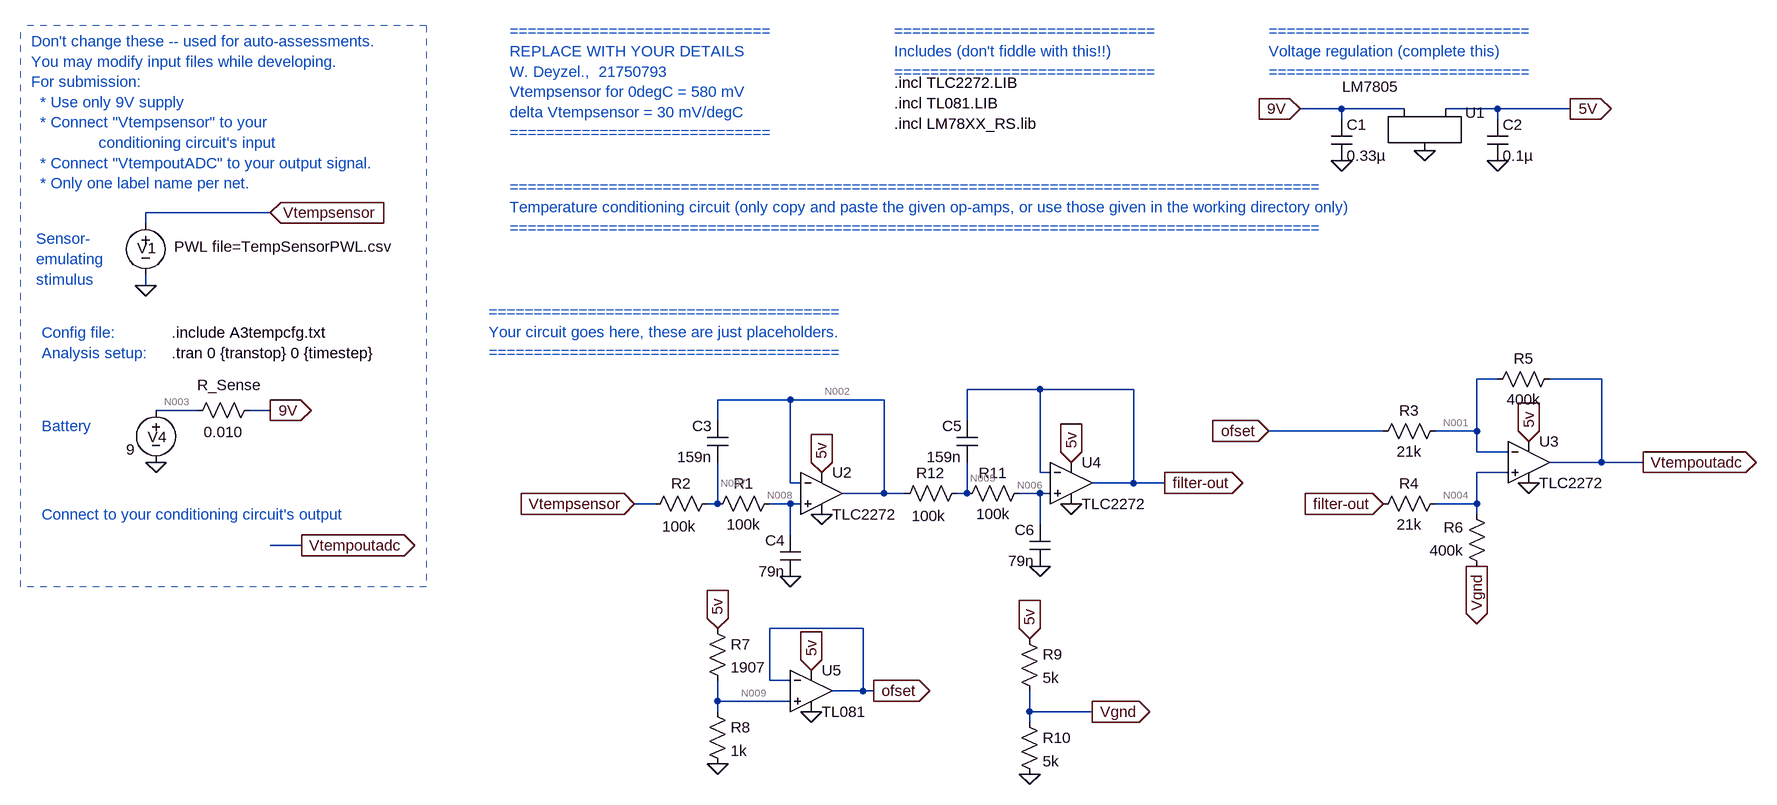
[diagram p0: schematic E344_A3_temp.asc]
E344_A3_temp.asc, the LTspice schematic file:
Version 4
SHEET 1 1824 680
WIRE -272 -1280 -336 -1280
WIRE -176 -1280 -272 -1280
WIRE -32 -1280 -112 -1280
WIRE 80 -1280 -32 -1280
WIRE -272 -1264 -272 -1280
WIRE -32 -1264 -32 -1280
WIRE -1920 -1120 -2112 -1120
WIRE -2112 -1104 -2112 -1120
WIRE -2112 -1008 -2112 -1024
WIRE -32 -864 -64 -864
WIRE 128 -864 48 -864
WIRE -736 -848 -848 -848
WIRE -592 -848 -736 -848
WIRE -1120 -832 -1232 -832
WIRE -976 -832 -1120 -832
WIRE -2032 -816 -2096 -816
WIRE -1920 -816 -1952 -816
WIRE -1232 -800 -1232 -832
WIRE -848 -800 -848 -848
WIRE -208 -784 -384 -784
WIRE -64 -784 -64 -864
WIRE -64 -784 -128 -784
WIRE -64 -752 -64 -784
WIRE -16 -752 -64 -752
WIRE 128 -736 128 -864
WIRE 128 -736 48 -736
WIRE 192 -736 128 -736
WIRE -736 -720 -736 -848
WIRE -720 -720 -736 -720
WIRE -16 -720 -64 -720
WIRE -1120 -704 -1120 -832
WIRE -1104 -704 -1120 -704
WIRE -592 -704 -592 -848
WIRE -592 -704 -656 -704
WIRE -544 -704 -592 -704
WIRE -976 -688 -976 -832
WIRE -976 -688 -1040 -688
WIRE -944 -688 -976 -688
WIRE -848 -688 -848 -736
WIRE -848 -688 -864 -688
WIRE -736 -688 -768 -688
WIRE -720 -688 -736 -688
WIRE -1328 -672 -1360 -672
WIRE -1232 -672 -1232 -736
WIRE -1232 -672 -1248 -672
WIRE -1120 -672 -1152 -672
WIRE -1104 -672 -1120 -672
WIRE -64 -672 -64 -720
WIRE -64 -672 -128 -672
WIRE -64 -656 -64 -672
WIRE -736 -640 -736 -688
WIRE -1120 -624 -1120 -672
WIRE -1872 -608 -1920 -608
WIRE -1008 -480 -1152 -480
WIRE -1152 -400 -1152 -480
WIRE -1120 -400 -1152 -400
WIRE -1008 -384 -1008 -480
WIRE -1008 -384 -1056 -384
WIRE -992 -384 -1008 -384
WIRE -1232 -368 -1232 -400
WIRE -1120 -368 -1232 -368
WIRE -1232 -352 -1232 -368
WIRE -752 -352 -752 -384
WIRE -656 -352 -752 -352
WIRE -752 -336 -752 -352
FLAG -2112 -1008 0
FLAG -1920 -1120 Vtempsensor
IOPIN -1920 -1120 In
FLAG -1920 -816 9V
IOPIN -1920 -816 Out
FLAG -2096 -736 0
FLAG -336 -1280 9V
IOPIN -336 -1280 In
FLAG -1360 -672 Vtempsensor
IOPIN -1360 -672 In
FLAG -144 -1216 0
FLAG 80 -1280 5V
IOPIN 80 -1280 Out
FLAG 192 -736 Vtempoutadc
IOPIN 192 -736 Out
FLAG -1872 -608 Vtempoutadc
IOPIN -1872 -608 Out
FLAG -272 -1200 0
FLAG -32 -1200 0
FLAG -1072 -656 0
FLAG -1072 -720 5v
IOPIN -1072 -720 In
FLAG -544 -704 filter-out
IOPIN -544 -704 Out
FLAG -1120 -560 0
FLAG -1232 -480 5v
IOPIN -1232 -480 In
FLAG -1232 -272 0
FLAG -992 -384 ofset
IOPIN -992 -384 Out
FLAG -208 -672 filter-out
IOPIN -208 -672 In
FLAG 16 -704 0
FLAG 16 -768 5v
IOPIN 16 -768 In
FLAG -752 -464 5v
IOPIN -752 -464 In
FLAG -752 -256 0
FLAG -656 -352 Vgnd
IOPIN -656 -352 Out
FLAG -64 -576 Vgnd
IOPIN -64 -576 Out
FLAG -688 -672 0
FLAG -688 -736 5v
IOPIN -688 -736 In
FLAG -736 -576 0
FLAG -384 -784 ofset
IOPIN -384 -784 In
FLAG -1088 -352 0
FLAG -1088 -416 5v
IOPIN -1088 -416 In
SYMBOL voltage -2112 -1120 R0
WINDOW 123 0 0 Left 0
WINDOW 39 0 0 Left 0
WINDOW 3 44 52 Left 2
WINDOW 0 -13 54 Left 2
SYMATTR Value PWL file=TempSensorPWL.csv
SYMATTR InstName V1
SYMBOL voltage -2096 -832 R0
WINDOW 123 24 44 Left 2
WINDOW 39 0 0 Left 0
WINDOW 3 -46 76 Left 2
WINDOW 0 -13 57 Left 2
SYMATTR Value 9
SYMATTR InstName V4
SYMBOL res -1936 -832 R90
WINDOW 0 -7 47 VBottom 2
WINDOW 3 34 56 VTop 2
SYMATTR InstName R_Sense
SYMATTR Value 0.010
SYMBOL LM7805 -144 -1264 R0
WINDOW 3 -83 -66 Top 2
SYMATTR InstName U1
SYMBOL cap -288 -1264 R0
SYMATTR InstName C1
SYMATTR Value 0.33µ
SYMBOL cap -48 -1264 R0
SYMATTR InstName C2
SYMATTR Value 0.1µ
SYMBOL res -1136 -688 R90
WINDOW 0 0 56 VBottom 2
WINDOW 3 32 56 VTop 2
SYMATTR InstName R1
SYMATTR Value 100k
SYMBOL res -1232 -688 R90
WINDOW 0 0 56 VBottom 2
WINDOW 3 35 59 VTop 2
SYMATTR InstName R2
SYMATTR Value 100k
SYMBOL cap -1216 -736 R180
WINDOW 0 24 56 Left 2
WINDOW 3 24 8 Left 2
SYMATTR InstName C3
SYMATTR Value 159n
SYMBOL cap -1104 -560 R180
WINDOW 0 24 56 Left 2
WINDOW 3 24 8 Left 2
SYMATTR InstName C4
SYMATTR Value 79n
SYMBOL Opamps\\opamp2 -1072 -752 R0
SYMATTR InstName U2
SYMATTR Value TLC2272
SYMBOL res -112 -800 R90
WINDOW 0 0 56 VBottom 2
WINDOW 3 32 56 VTop 2
SYMATTR InstName R3
SYMATTR Value 21k
SYMBOL res -112 -688 R90
WINDOW 0 0 56 VBottom 2
WINDOW 3 32 56 VTop 2
SYMATTR InstName R4
SYMATTR Value 21k
SYMBOL res 64 -880 R90
WINDOW 0 0 56 VBottom 2
WINDOW 3 32 56 VTop 2
SYMATTR InstName R5
SYMATTR Value 400k
SYMBOL res -48 -560 R180
WINDOW 0 36 76 Left 2
WINDOW 3 36 40 Left 2
SYMATTR InstName R6
SYMATTR Value 400k
SYMBOL res -1248 -496 R0
SYMATTR InstName R7
SYMATTR Value 1907
SYMBOL res -1248 -368 R0
SYMATTR InstName R8
SYMATTR Value 1k
SYMBOL Opamps\\opamp2 16 -800 R0
SYMATTR InstName U3
SYMATTR Value TLC2272
SYMBOL res -768 -480 R0
SYMATTR InstName R9
SYMATTR Value 5k
SYMBOL res -768 -352 R0
SYMATTR InstName R10
SYMATTR Value 5k
SYMBOL res -752 -704 R90
WINDOW 0 0 56 VBottom 2
WINDOW 3 32 56 VTop 2
SYMATTR InstName R11
SYMATTR Value 100k
SYMBOL res -848 -704 R90
WINDOW 0 0 56 VBottom 2
WINDOW 3 35 59 VTop 2
SYMATTR InstName R12
SYMATTR Value 100k
SYMBOL cap -832 -736 R180
WINDOW 0 24 56 Left 2
WINDOW 3 24 8 Left 2
SYMATTR InstName C5
SYMATTR Value 159n
SYMBOL cap -720 -576 R180
WINDOW 0 24 56 Left 2
WINDOW 3 24 8 Left 2
SYMATTR InstName C6
SYMATTR Value 79n
SYMBOL Opamps\\opamp2 -688 -768 R0
SYMATTR InstName U4
SYMATTR Value TLC2272
SYMBOL Opamps\\opamp2 -1088 -448 R0
SYMATTR InstName U5
SYMATTR Value TL081
TEXT -2072 -904 Left 2 !.tran 0 {transtop} 0 {timestep}
TEXT -2072 -936 Left 2 !.include A3tempcfg.txt
TEXT -2288 -1384 Left 2 ;Don't change these -- used for auto-assessments.\nYou may modify input files while developing.\nFor submission: \n  * Use only 9V supply \n  * Connect "Vtempsensor" to your \n               conditioning circuit's input\n  * Connect "VtempoutADC" to your output signal.\n  * Only one label name per net.
TEXT -2272 -936 Left 2 ;Config file:
TEXT -2272 -904 Left 2 ;Analysis setup:
TEXT -2272 -792 Left 2 ;Battery
TEXT -2280 -1080 Left 2 ;Sensor-\nemulating \nstimulus
TEXT -1552 -1400 Left 2 ;=============================\nREPLACE WITH YOUR DETAILS\nW. Deyzel.,  21750793\nVtempsensor for 0degC = 580 mV\ndelta Vtempsensor = 30 mV/degC\n=============================
TEXT -1552 -1160 Left 2 ;==========================================================================================\nTemperature conditioning circuit (only copy and paste the given op-amps, or use those given in the working directory only)\n==========================================================================================
TEXT -384 -1400 Left 2 ;=============================\nVoltage regulation (complete this)\n=============================
TEXT -960 -1320 Left 2 !.incl TLC2272.LIB\n.incl TL081.LIB\n.incl LM78XX_RS.lib
TEXT -2272 -656 Left 2 ;Connect to your conditioning circuit's output
TEXT -960 -1400 Left 2 ;=============================\nIncludes (don't fiddle with this!!)\n=============================
TEXT -1584 -968 Left 2 ;=======================================\nYour circuit goes here, these are just placeholders.\n=======================================
LINE Normal -2304 -544 -2304 -1408 1
LINE Normal -1680 -1408 -1680 -544 1
LINE Normal -1680 -544 -2304 -544 1
LINE Normal -1680 -1408 -2304 -1408 1

The netlist it stands for:
* E344_A3_temp.asc
V1 Vtempsensor 0 PWL file=TempSensorPWL.csv
V4 N003 0 9
R_Sense 9V N003 0.010
XU1 9V 0 5V LM7805
C1 9V 0 0.33µ
C2 5V 0 0.1µ
R1 N008 N007 100k
R2 N007 Vtempsensor 100k
C3 N007 N002 159n
C4 0 N008 79n
XU2 N008 N002 5V 0 N002 TLC2272  ; pins In+ In- V+ V- OUT
R3 N001 ofset 21k
R4 N004 filter-out 21k
R5 Vtempoutadc N001 400k
R6 Vgnd N004 400k
R7 5V N009 1907
R8 N009 0 1k
XU3 N004 N001 5V 0 Vtempoutadc TLC2272  ; pins In+ In- V+ V- OUT
R9 5V Vgnd 5k
R10 Vgnd 0 5k
R11 N006 N005 100k
R12 N005 N002 100k
C5 N005 filter-out 159n
C6 0 N006 79n
XU4 N006 filter-out 5V 0 filter-out TLC2272  ; pins In+ In- V+ V- OUT
XU5 N009 ofset 5V 0 ofset TL081  ; pins In+ In- V+ V- OUT
.tran 0 {transtop} 0 {timestep}
.include A3tempcfg.txt
* Don't change these -- used for auto-assessments.
* You may modify input files while developing.
* For submission:
*   * Use only 9V supply
*   * Connect "Vtempsensor" to your
*                conditioning circuit's input
*   * Connect "VtempoutADC" to your output signal.
*   * Only one label name per net.
* Config file:
* Analysis setup:
* Battery
* Sensor-
* emulating
* stimulus
* =============================
* REPLACE WITH YOUR DETAILS
* W. Deyzel.,  21750793
* Vtempsensor for 0degC = 580 mV
* delta Vtempsensor = 30 mV/degC
* =============================
* ==========================================================================================
* Temperature conditioning circuit (only copy and paste the given op-amps, or use those given in the working directory only)
* ==========================================================================================
* =============================
* Voltage regulation (complete this)
* =============================
.incl TLC2272.LIB
.incl TL081.LIB
.incl LM78XX_RS.lib
* Connect to your conditioning circuit's output
* =============================
* Includes (don't fiddle with this!!)
* =============================
* =======================================
* Your circuit goes here, these are just placeholders.
* =======================================
.backanno
.end

* Results of the author's LTspice run, read from the files saved beside the schematic
* Operating Point, zero values left out:
*   V(vtempsensor) = 1.84 V
*   V(n003) = 9 V
*   V(9v) = 9 V
*   V(5v) = 5.003 V
*   V(n008) = 1.84 V
*   V(n007) = 1.84 V
*   V(n002) = 1.84 V
*   V(n001) = 1.874 V
*   V(ofset) = 1.721 V
*   V(n004) = 1.874 V
*   V(filter-out) = 1.841 V
*   V(vtempoutadc) = 4.78 V
*   V(vgnd) = 2.498 V
*   V(n009) = 1.721 V
*   V(n006) = 1.84 V
*   V(n005) = 1.84 V
*   I(R10) = 499.5 µA
*   I(R9) = 501.1 µA
*   I(R8) = 1.721 mA
*   I(R7) = 1.721 mA
*   I(R6) = 1.56 µA
*   I(R5) = 7.265 µA
*   I(R4) = 1.56 µA
*   I(R3) = 7.265 µA
*   I(R_sense) = -16.98 mA
*   I(V4) = -16.98 mA